# Altium schematic sheet Vsense 0-223.3V.SchDoc: Vsense from 0 to 223.3V
size A4; Date: 2017-07-12; DocumentNumber: 13; Revision: A; SheetNumber: 13; SheetTotal: 16; DesignedBy: Mike MacKay
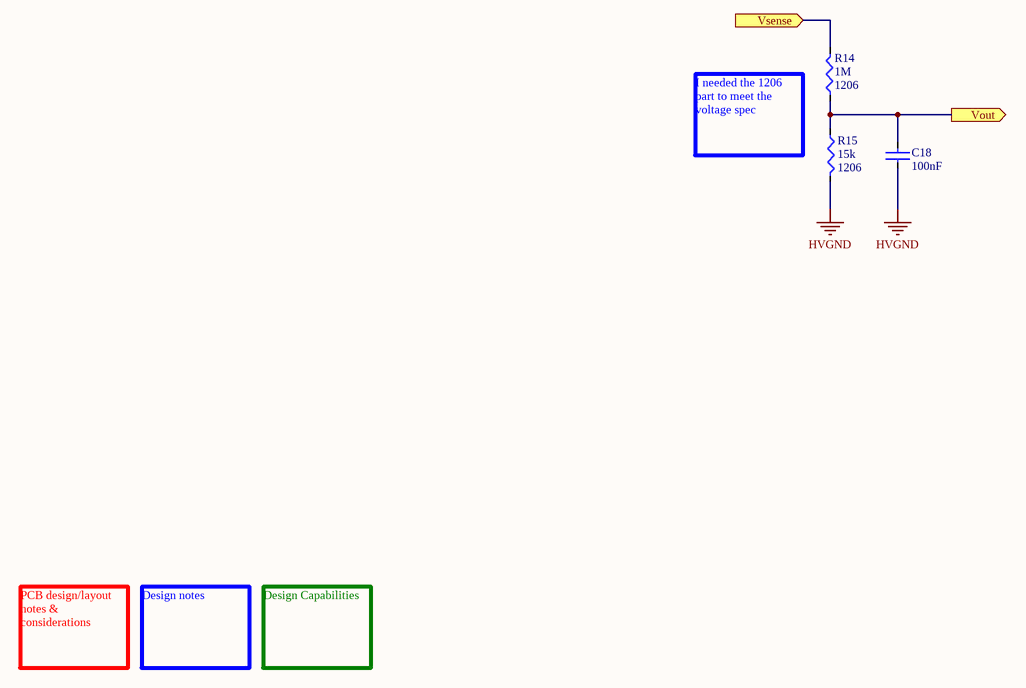
[diagram p0: Vsense 0-223.3V.SchDoc]

## Parts
C18  Capacitance: 100nF  [C0603 - Ceramic]  (hidden comment: 100nF 0603 50V)
R14  Resistance (Ohms): 1M  Supplier Device Package: 1206  [R1210]  (hidden comment: 1M 1206 1%)
R15  Resistance (Ohms): 15k  Supplier Device Package: 1206  [R1210]  (hidden comment: Template - Resistor)

## Ports
Vout (out), Vsense (in)

## Nets
HVGND: C18.2 R15.1
Vout: C18.1 R14.2 R15.2 ; port Vout
Vsense: R14.1 ; port Vsense

## Notes on the sheet
- I needed the 1206 part to meet the voltage spec
- PCB design/layout notes & considerations
- Design notes
- Design Capabilities
- Repository Version
- BOM/Variant

## Library data of the parts
C18 = 100nF 0603 50V: Manufacturer: Samsung Electro-Mechanics America, Inc; Manufacturer Part Number: CL10B104KB8SFNC; Tolerance: ±10%; Temperature Coefficient: X7R; Value: 100nF 0603 50V; Supplier 1: Digi-Key; RoHS: RoHS Compliant; Category: Capacitors; Stock 1: 1192070; Pricing 1: 1=0.1, 10=0.027, 25=0.0192, 100=0.0125, 500=0.00874, 1000=0.00681 (USD); Packaging: Cut Tape (CT); Voltage - Rated: 50V; Mounting Type: Surface Mount, MLCC; Operating Temperature: -55°C ~ 125°C; Applications: Boardflex Sensitive; Ratings: -; Package / Case: 0603 (1608 Metric); Size / Dimension: 0.063" L x 0.031" W (1.60mm x 0.80mm); Height - Seated (Max): -; Thickness (Max): 0.035" (0.90mm); Lead Spacing: -; Features: Soft Termination; Lead Style: -; ComponentLink1URL: http://www.samsungsem.com/kr/front/downloadcms.do?path=/kr/support/product-search/mlcc/__icsFiles/afieldfile/2014/11/05&fileName=S_CL10B104KB8SFNC.pdf; ComponentLink1Description: http://www.samsungsem.com/kr/front/downloadcms.do?path=/kr/support/product-search/mlcc/__icsFiles/afieldfile/2014/11/05&fileName=S_CL10B104KB8SFNC.pdf; Supplier Part Number 1: 1276-1936-1-ND
R14 = 1M 1206 1%: Resistor; Manufacturer: Yageo; Manufacturer Part Number: RV1206FR-071ML; Power (Watts): 0.25W, 1/4W; Temperature Coefficient: ±200ppm/°C; Value: 1M 1206 1%; Supplier 1: Digi-Key; Supplier Part Number 1: 311-1MNICT-ND; RoHS: RoHS Compliant; Category: Resistors; Stock 1: 79790; Pricing 1: 1=0.34, 10=0.289, 25=0.2104, 50=0.1526, 100=0.1131, 250=0.0868, 500=0.06838, 1000=0.04734 (USD); Packaging: Cut Tape (CT); Part Status: Active; Tolerance: ±1%; Composition: Thick Film; Features: High Voltage, Moisture Resistant; Operating Temperature: -55°C ~ 155°C; Package / Case: 1206; Size / Dimension: 0.122" L x 0.063" W (3.10mm x 1.60mm); Height - Seated (Max): 0.026" (0.65mm); Number of Terminations: 2; Failure Rate: -; ComponentLink1URL: http://www.yageo.com/documents/recent/PYu-RV_51_RoHS_L_6.pdf; ComponentLink1Description: Spec Sheet
R15 = Template - Resistor: Manufacturer: Yageo; Manufacturer Part Number: RC1206FR-0715KL; Value: 15k 1206 1%; Tolerance: ±1%; Power (Watts): 0.25W, 1/4W; Temperature Coefficient: ±100ppm/°C; Supplier 1: Digi-Key; Supplier Part Number 1: 311-15.0KFRCT-ND; RoHS: RoHS Compliant; Category: Resistors; Stock 1: 143517; Pricing 1: 1=0.1, 10=0.029, 25=0.0212, 50=0.016, 100=0.0118, 250=0.009, 500=0.0072, 1000=0.0053 (USD); Packaging: Cut Tape (CT); Part Status: Active; Composition: Thick Film; Features: Moisture Resistant; Operating Temperature: -55°C ~ 155°C; Package / Case: 1206 (3216 Metric); Size / Dimension: 0.122" L x 0.063" W (3.10mm x 1.60mm); Height - Seated (Max): 0.026" (0.65mm); Number of Terminations: 2; Failure Rate: -; ComponentLink1URL: http://www.yageo.com/NewPortal/yageodocoutput?fileName=/pdf/R-Chip/PYu-RC_Group_51_RoHS_L_4.pdf; ComponentLink1Description: http://www.yageo.com/NewPortal/yageodocoutput?fileName=/pdf/R-Chip/PYu-RC_Group_51_RoHS_L_4.pdf